# Altium schematic sheet motordriver-v5.0_trinamic-controller.SchDoc
size B; SheetNumber: 4; SheetTotal: 10
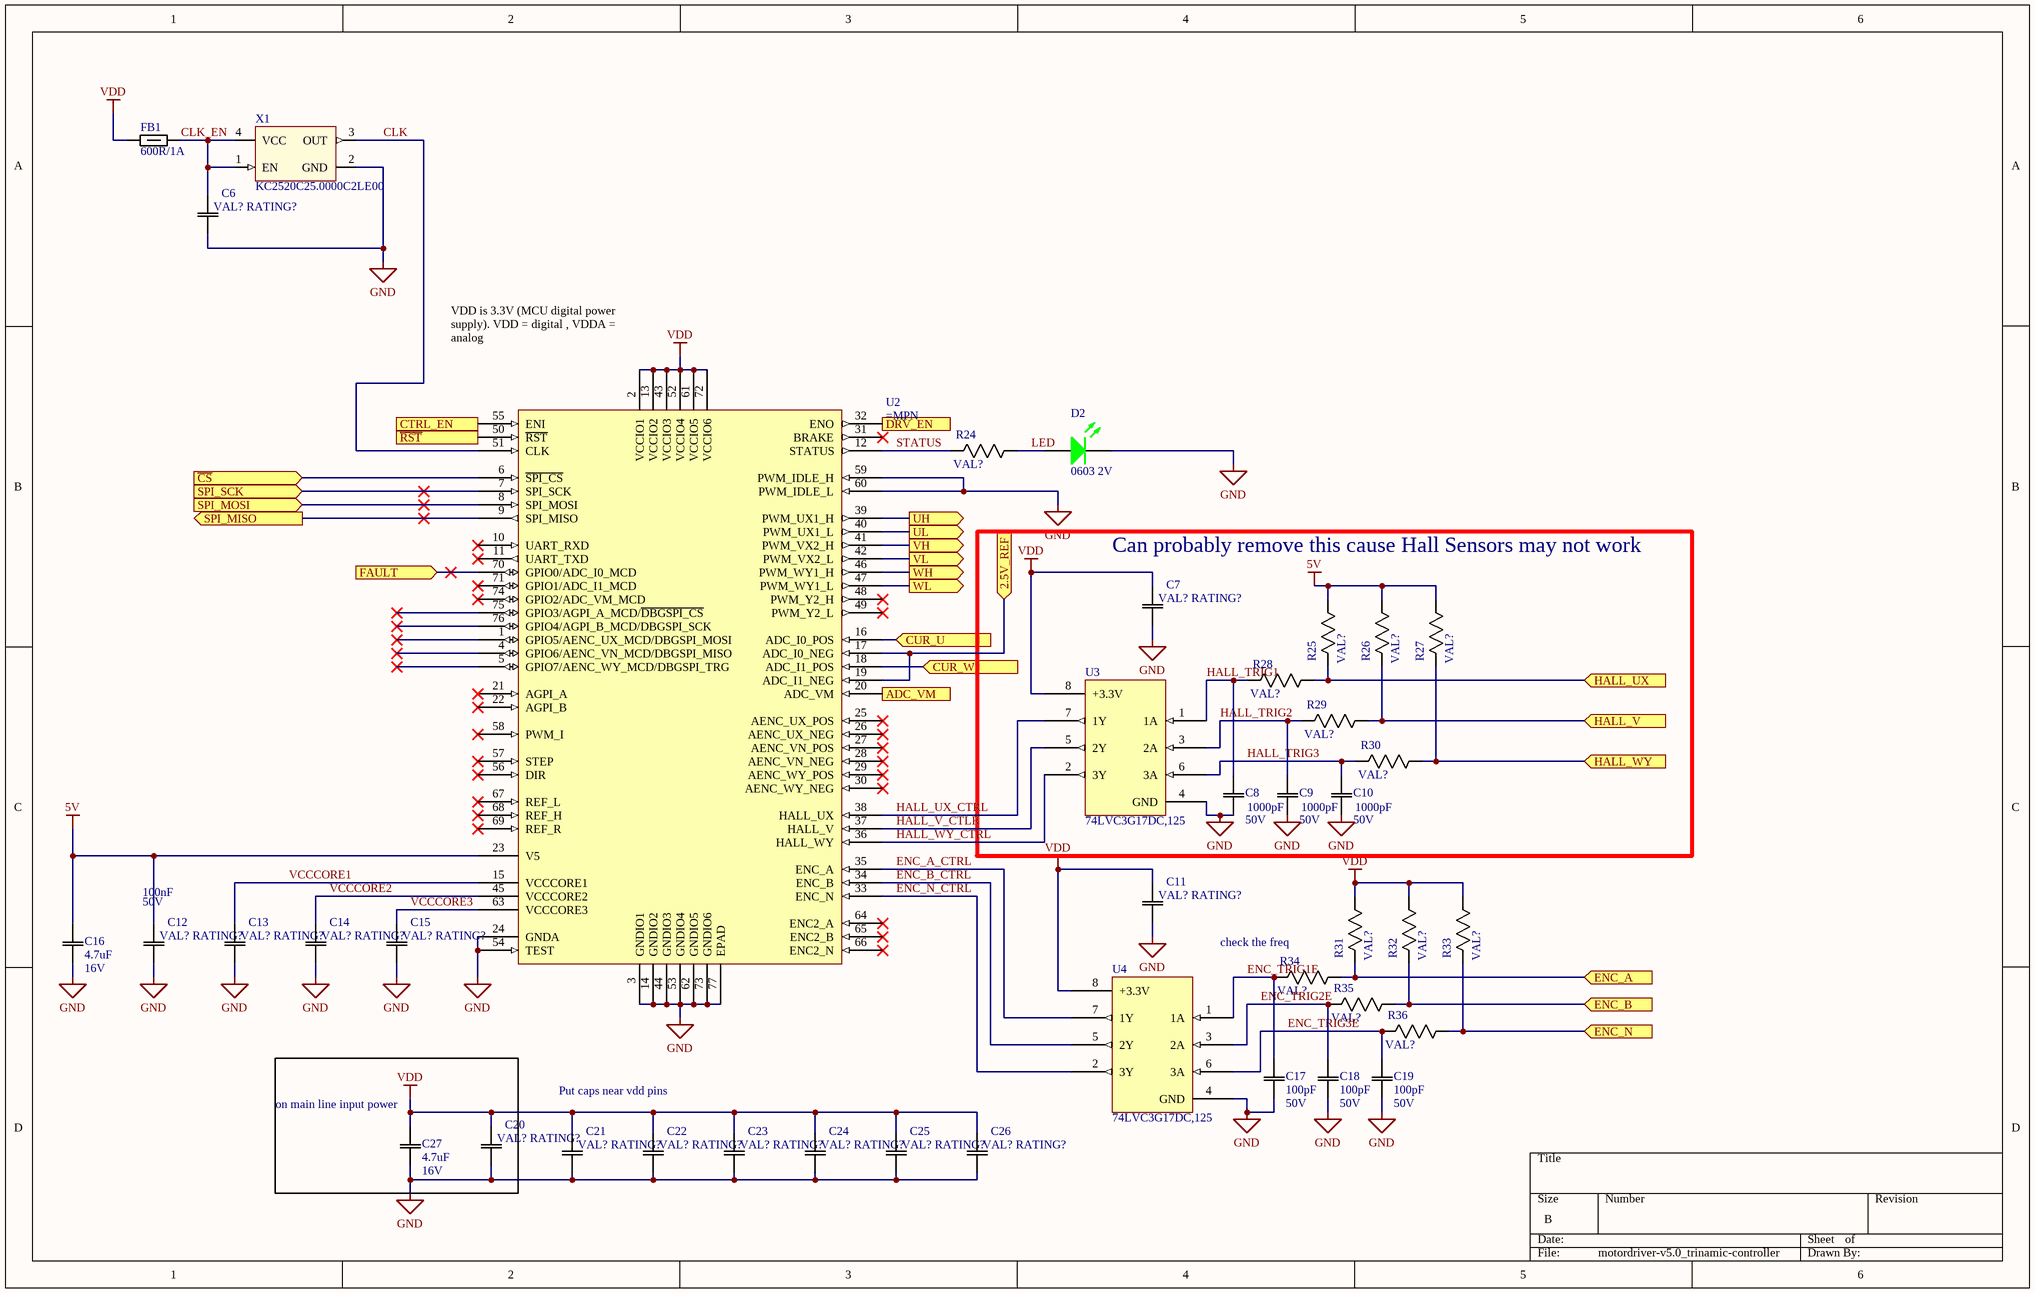
[diagram p0: motordriver-v5.0_trinamic-controller.SchDoc]

## Parts
C6  VAL? RATING?  [0603]
C7  VAL? RATING?  [0603]
C8  value 1000pF  Rating: 50V  [0603]  (hidden comment: VAL? RATING?)
C9  value 1000pF  Rating: 50V  [0603]  (hidden comment: VAL? RATING?)
C10  value 1000pF  Rating: 50V  [0603]  (hidden comment: VAL? RATING?)
C11  VAL? RATING?  [0603]
C12  VAL? RATING?  value 100nF  Rating: 50V  [0603]
C13  VAL? RATING?  [0603]
C14  VAL? RATING?  [0603]
C15  VAL? RATING?  [0603]
C16  value 4.7uF  Rating: 16V  [0603]  (hidden comment: VAL? RATING?)
C17  value 100pF  Rating: 50V  [0603]  (hidden comment: VAL? RATING?)
C18  value 100pF  Rating: 50V  [0603]  (hidden comment: VAL? RATING?)
C19  value 100pF  Rating: 50V  [0603]  (hidden comment: VAL? RATING?)
C20  VAL? RATING?  [0603]
C21  VAL? RATING?  [0603]
C22  VAL? RATING?  [0603]
C23  VAL? RATING?  [0603]
C24  VAL? RATING?  [0603]
C25  VAL? RATING?  [0603]
C26  VAL? RATING?  [0603]
C27  value 4.7uF  Rating: 16V  [0603]  (hidden comment: VAL? RATING?)
D2  0603 2V  [0603 - LED]
FB1  600R/1A  [0603]
R24  VAL?  [0603]
R25  VAL?  [0603]
R26  VAL?  [0603]
R27  VAL?  [0603]
R28  VAL?  [0603]
R29  VAL?  [0603]
R30  VAL?  [0603]
R31  VAL?  [0603]
R32  VAL?  [0603]
R33  VAL?  [0603]
R34  VAL?  [0603]
R35  VAL?  [0603]
R36  VAL?  [0603]
U2  (no value)  [QFN40P1050X650X90_HS-77N]
U3  74LVC3G17DC,125  [8-VSSOP]
U4  74LVC3G17DC,125  [8-VSSOP]
X1  KC2520C25.0000C2LE00  [KC2520C25.0000C2LE00]

## Blocks framed on the sheet
Can probably remove this cause Hall Sensors may not work: C7-C10 R25-R30 U3
on main line input power: C20 C27

## Ports
2.5V_REF (in), ADC_VM (in), CTRL_EN (in), CUR_U (in), CUR_W (in), DRV_EN (out), ENC_A (in), ENC_B (in), ENC_N (in), FAULT (in), HALL_UX (in), HALL_V (in), HALL_WY (in), SPI_MISO (out), SPI_MOSI (in), SPI_SCK (in), UH (out), UL (out), VH (out), VL (out), WH (out), WL (out), ~{CS} (in), ~{RST} (in)

## Nets
5V: C12.2(C2) C16.2(C2) R25.1(R1) R26.1(R1) R27.1(R1) U2.23(V5)
GND: C6.1(C1) C7.1(C1) C8.1(C1) C9.1(C1) C10.1(C1) C11.1(C1) C12.1(C1) C13.1(C1) C14.1(C1) C15.1(C1) C16.1(C1) C17.1(C1) C18.1(C1) C19.1(C1) C20.1(C1) C21.1(C1) C22.1(C1) C23.1(C1) C24.1(C1) C25.1(C1) C26.1(C1) C27.1(C1) D2.2(K) U2.3(GNDIO1) U2.14(GNDIO2) U2.24(GNDA) U2.44(GNDIO3) U2.53(GNDIO4) U2.54(TEST) U2.59(PWM_IDLE_H) U2.60(PWM_IDLE_L) U2.62(GNDIO5) U2.73(GNDIO6) U2.77(EPAD) U3.4(GND) U4.4(GND) X1.2(GND)
VDD: C7.2(C2) C11.2(C2) C20.2(C2) C21.2(C2) C22.2(C2) C23.2(C2) C24.2(C2) C25.2(C2) C26.2(C2) C27.2(C2) FB1.1 R31.1(R1) R32.1(R1) R33.1(R1) U2.2(VCCIO1) U2.13(VCCIO2) U2.43(VCCIO3) U2.52(VCCIO4) U2.61(VCCIO5) U2.72(VCCIO6) U3.8(+3.3V) U4.8(+3.3V)
2.5V_REF: U2.17(ADC_I0_NEG) U2.19(ADC_I1_NEG) ; port 2.5V_REF
ADC_VM: U2.20(ADC_VM) ; port ADC_VM
~{CS}: U2.6(~{SPI_CS}) ; port ~{CS}
CLK: U2.51(CLK) X1.3(OUT)
CLK_EN: C6.2(C2) FB1.2 X1.1(EN) X1.4(VCC)
CTRL_EN: U2.55(ENI) ; port CTRL_EN
CUR_U: U2.16(ADC_I0_POS) ; port CUR_U
CUR_W: U2.18(ADC_I1_POS) ; port CUR_W
DRV_EN: U2.32(ENO) ; port DRV_EN
ENC_A: R31.2(R2) R34.1(R1) ; port ENC_A
ENC_A_CTRL: U2.35(ENC_A) U4.7(1Y)
ENC_B: R32.2(R2) R35.1(R1) ; port ENC_B
ENC_B_CTRL: U2.34(ENC_B) U4.5(2Y)
ENC_N: R33.2(R2) R36.1(R1) ; port ENC_N
ENC_N_CTRL: U2.33(ENC_N) U4.2(3Y)
ENC_TRIG1E: C17.2(C2) R34.2(R2) U4.1(1A)
ENC_TRIG2E: C18.2(C2) R35.2(R2) U4.3(2A)
ENC_TRIG3E: C19.2(C2) R36.2(R2) U4.6(3A)
FAULT: U2.70(GPIO0/ADC_I0_MCD) ; port FAULT
HALL_TRIG1: C8.2(C2) R28.2(R2) U3.1(1A)
HALL_TRIG2: C9.2(C2) R29.2(R2) U3.3(2A)
HALL_TRIG3: C10.2(C2) R30.2(R2) U3.6(3A)
HALL_UX: R25.2(R2) R28.1(R1) ; port HALL_UX
HALL_UX_CTRL: U2.38(HALL_UX) U3.7(1Y)
HALL_V: R26.2(R2) R29.1(R1) ; port HALL_V
HALL_V_CTLR: U2.37(HALL_V) U3.5(2Y)
HALL_WY: R27.2(R2) R30.1(R1) ; port HALL_WY
HALL_WY_CTRL: U2.36(HALL_WY) U3.2(3Y)
LED: D2.1(A) R24.1(R1)
~{RST}: U2.50(~{RST}) ; port ~{RST}
SPI_MISO: U2.9(SPI_MISO) ; port SPI_MISO
SPI_MOSI: U2.8(SPI_MOSI) ; port SPI_MOSI
SPI_SCK: U2.7(SPI_SCK) ; port SPI_SCK
STATUS: R24.2(R2) U2.12(STATUS)
UH: U2.39(PWM_UX1_H) ; port UH
UL: U2.40(PWM_UX1_L) ; port UL
VCCCORE1: C13.2(C2) U2.15(VCCCORE1)
VCCCORE2: C14.2(C2) U2.45(VCCCORE2)
VCCCORE3: C15.2(C2) U2.63(VCCCORE3)
VH: U2.41(PWM_VX2_H) ; port VH
VL: U2.42(PWM_VX2_L) ; port VL
WH: U2.46(PWM_WY1_H) ; port WH
WL: U2.47(PWM_WY1_L) ; port WL

Not connected (* = marked no-connect by the designer): U2 1(GPIO5/AENC_UX_MCD/DBGSPI_MOSI)* 4(GPIO6/AENC_VN_MCD/DBGSPI_MISO)* 5(GPIO7/AENC_WY_MCD/DBGSPI_TRG)* 10(UART_RXD)* 11(UART_TXD)* 21(AGPI_A)* 22(AGPI_B)* 25(AENC_UX_POS)* 26(AENC_UX_NEG)* 27(AENC_VN_POS)* 28(AENC_VN_NEG)* 29(AENC_WY_POS)* 30(AENC_WY_NEG)* 31(BRAKE)* 48(PWM_Y2_H)* 49(PWM_Y2_L)* 56(DIR)* 57(STEP)* 58(PWM_I)* 64(ENC2_A)* 65(ENC2_B)* 66(ENC2_N)* 67(REF_L)* 68(REF_H)* 69(REF_R)* 71(GPIO1/ADC_I1_MCD)* 74(GPIO2/ADC_VM_MCD)* 75(GPIO3/AGPI_A_MCD/~{DBGSPI_CS})* 76(GPIO4/AGPI_B_MCD/DBGSPI_SCK)*

## Notes on the sheet
- (near U2) VDD is 3.3V (MCU digital power supply). VDD = digital , VDDA = analog
- (near R34) check the freq
- Put caps near vdd pins

## Library data of the parts
C6 C7 C11 C13-C15 C21-C26 = CAP 100nF 50V: Default Symbol for Capacitors; Manufacturer Part Number 1: CC0603KPX7R9BB104; Value: 100nF; Tolerance: 10%; Rating: 50V; Temperature Coefficient: X7R; Part Number: CAP 100nF 50V; Supplier 1: Digi-Key; Supplier Part Number 1: 311-3567-1-ND; Manufacturer Part Number 2: 0805J0500104KJT; Supplier 2: Digi-Key; Supplier Part Number 2: 1608-1458-1-ND
C8-C10 = CAP 1000pF 50V: Default Symbol for Capacitors; Manufacturer Part Number 1: 06035C102K4Z2A / 06035C102K4Z2A; Tolerance: 10%; Temperature Coefficient: X7R; Part Number: CAP 1000pF 50V; Supplier 1: Digi-Key; Supplier Part Number 1: 478-6342-1-ND; Manufacturer Part Number 2: 08055C102KAT2A; Supplier 2: Digi-Key; Supplier Part Number 2: 478-1371-1-ND
C12 = CAP 100nF 50V: Default Symbol for Capacitors; Manufacturer Part Number 1: CC0603KPX7R9BB104; Tolerance: 10%; Temperature Coefficient: X7R; Part Number: CAP 100nF 50V; Supplier 1: Digi-Key; Supplier Part Number 1: 311-3567-1-ND; Manufacturer Part Number 2: 0805J0500104KJT; Supplier 2: Digi-Key; Supplier Part Number 2: 1608-1458-1-ND
C16 C27 = CAP 4.7uF 16V: Default Symbol for Capacitors; Manufacturer Part Number 1: C1608X5R1C475K080AE; Tolerance: 10%; Temperature Coefficient: X5R; Part Number: CAP 4.7uF 16V; Supplier 1: Digi-Key; Supplier Part Number 1: 445-175225-1-ND; Manufacturer Part Number 2: C2012X5R1C475K085AB; Supplier 2: Digi-Key; Supplier Part Number 2: 445-14382-1-ND
C17-C19 = CAP 100pF 50V: Default Symbol for Capacitors; Manufacturer Part Number 1: C0603C101K5RAC7867; Tolerance: 10%; Temperature Coefficient: X7R; Part Number: CAP 100pF 50V; Supplier 1: Digi-Key; Supplier Part Number 1: 399-C0603C101K5RAC7867CT-ND; Manufacturer Part Number 2: C0805C101J5RAC7800; Supplier 2: Digi-Key; Supplier Part Number 2: 399-17420-1-ND
C20 = CAP 470nF 50V: Default Symbol for Capacitors; Manufacturer Part Number 1: C1608X7R1H474K080AC; Value: 470nF; Tolerance: 10%; Rating: 50V; Temperature Coefficient: X7R; Part Number: CAP 470nF 50V; Supplier 1: Digi-Key; Supplier Part Number 1: 445-5952-1-ND; Manufacturer Part Number 2: CL21B474KBFNNNG; Supplier 2: Digi-Key; Supplier Part Number 2: 1276-6482-1-ND
D2 = LED GREEN SMD 0603: LED Uni-Color Green 574nm 2-Pin Chip LED T/R; Manufacturer Part Number: LTST-C190KGKT; Current Rating: 20mA; Supplier 1: Digi-Key; Supplier Part Number 1: 160-1435-1-ND; Part Number: LED GREEN SMD 0603; Supplier URL 1: https://www.digikey.ca/en/products/detail/lite-on-inc/LTST-C190KGKT/386815?s=N4IgTCBcDaIIwDYAMBaOAWAzAVjSgcgCIgC6AvkA; Pin Count: 2; Voltage Rating - DC: 2V
FB1 = FERRITE BEAD 200 MOHM 0603 1LN: WURTH ELEKTRONIK - 742792651 - Ferrite Bead, 0603 [1608 Metric], 600 ohm, 1 A, WE-CBF Series, 0.2 ohm, &#177; 25%; Manufacturer Part Number: 742792651-220-R; Value: 600R/1A @ 100 MHz; Supplier 1: Digi-Key; Supplier Part Number 1: 732-1593-1-ND; Part Number: FERRITE BEAD 200 MOHM 0603 1LN; Supplier URL 1: https://www.digikey.ca/en/products/detail/w%C3%BCrth-elektronik/742792651/1638997?s=N4IgTCBcDaIOwGYwFoCMBWAnAtyByAIiALoC%2BQA
R24 = RES 75.0 1/8W - 5%: Default Resistor Symbol; Manufacturer Part Number 1: RMCF0805JT75R0; Value: 75; Power (Watts): 0.125W; Tolerance: 5%; Tolerance 2: 1%; Package: 0805; Part Number: RES 75.0 1/8W - 5%; Supplier 1: Digi-Key; Supplier Part Number 1: RMCF0805JT75R0CT-ND; Manufacturer Part Number 2: RNCP0603FTD75R0; Supplier 2: Digi-Key; Supplier Part Number 2: RNCP0603FTD75R0CT-ND
R25-R33 = RES 4.7k 1/8W - 5%: Default Resistor Symbol; Value: 1; Power (Watts): 0.125W; Tolerance: 5%; Package: 0805; Part Number: RES 4.7k 1/8W - 5%
R34-R36 = RES 1k 1/8W - 1%: Default Resistor Symbol; Manufacturer Part Number 1: MCT06030C1001FP500; Value: 1k; Power (Watts): 0.125W; Tolerance: 1%; Package: 0805; Part Number: RES 1k 1/8W - 1%; Supplier 1: Digi-Key; Supplier Part Number 1: MCT0603-1.00K-CFCT-ND; Manufacturer Part Number 2: RMCF0805FT1K00; Supplier 2: Digi-Key; Supplier Part Number 2: RMCF0805FT1K00CT-ND; Tolerance 2: 1%
U2 = TMC4671: Motor Driver, -40 To 125Deg C Rohs Compliant: Yes; Manufacturer Part Number: TMC4671-LA; Supplier 1: Digi-Key; Supplier Part Number 1: 1460-TMC4671-LA-ND; Part Number: TMC4671; Suppler URL 1: https://www.digikey.ca/en/products/detail/trinamic-motion-control-gmbh/TMC4671-LA/12174669?s=N4IgTCBcDaIIwBYBsAGAtAFQLIGFkHY40AZAQTQDkAREAXQF8g
U3 U4 = IC 74LVC3G17DC,125: IC BUFFER TRIPLE SCHMITT TRIGGER 5.5V VSSOP-8; Manufacturer: Nexperia; Supplier 1: Newark; Manufacturer Part Number: 74LVC3G17DC,125; RoHS: Yes; Category: Logic Gates; Stock 1: 2995; Pricing 1: 1=0.84800, 5=0.83500, 10=0.70800, 25=0.62000, 50=0.53200, 100=0.44500, 250=0.41300, 500=0.38300, 1000=0.35200 (USD); RoHS Compliant: Yes; Supplier Part Number 1: 33AC1281
X1 = XTAL OSC 25MHz 3.3V: Oscillator XO 25MHz ±15ppm 15pF CMOS 55% 2.5V/3.3V 4-Pin Mini-CSMD T/R; Frequency: 32.768kHz; Load Capacitance: 12.5pF; Supplier 1: Digi-Key; Manufacturer Part Number: KC2520C25.0000C2LE00; Supplier Part Number 1: 1253-1254-6-ND; Part Number: XTAL OSC 25MHz 3.3V; Supplier URL 1: https://www.digikey.ca/en/products/detail/kyocera-avx/KC2520C25-0000C2LE00/4867084?s=N4IgTCBcDaIIxgKwGYC0DEBZUDZUDkAREAXQF8g